# EasyEDA Pro project MicrowaveOvenControl.eprj

# Schematic Schematic1
Board Name: Board1; Create Date: 2025-04-27; Page Name: P1; Project Name: MicrowaveOwenControl; Schematic Name: Schematic1; Update Date: 2025-05-22; Add into BOM: yes; Convert to PCB: yes
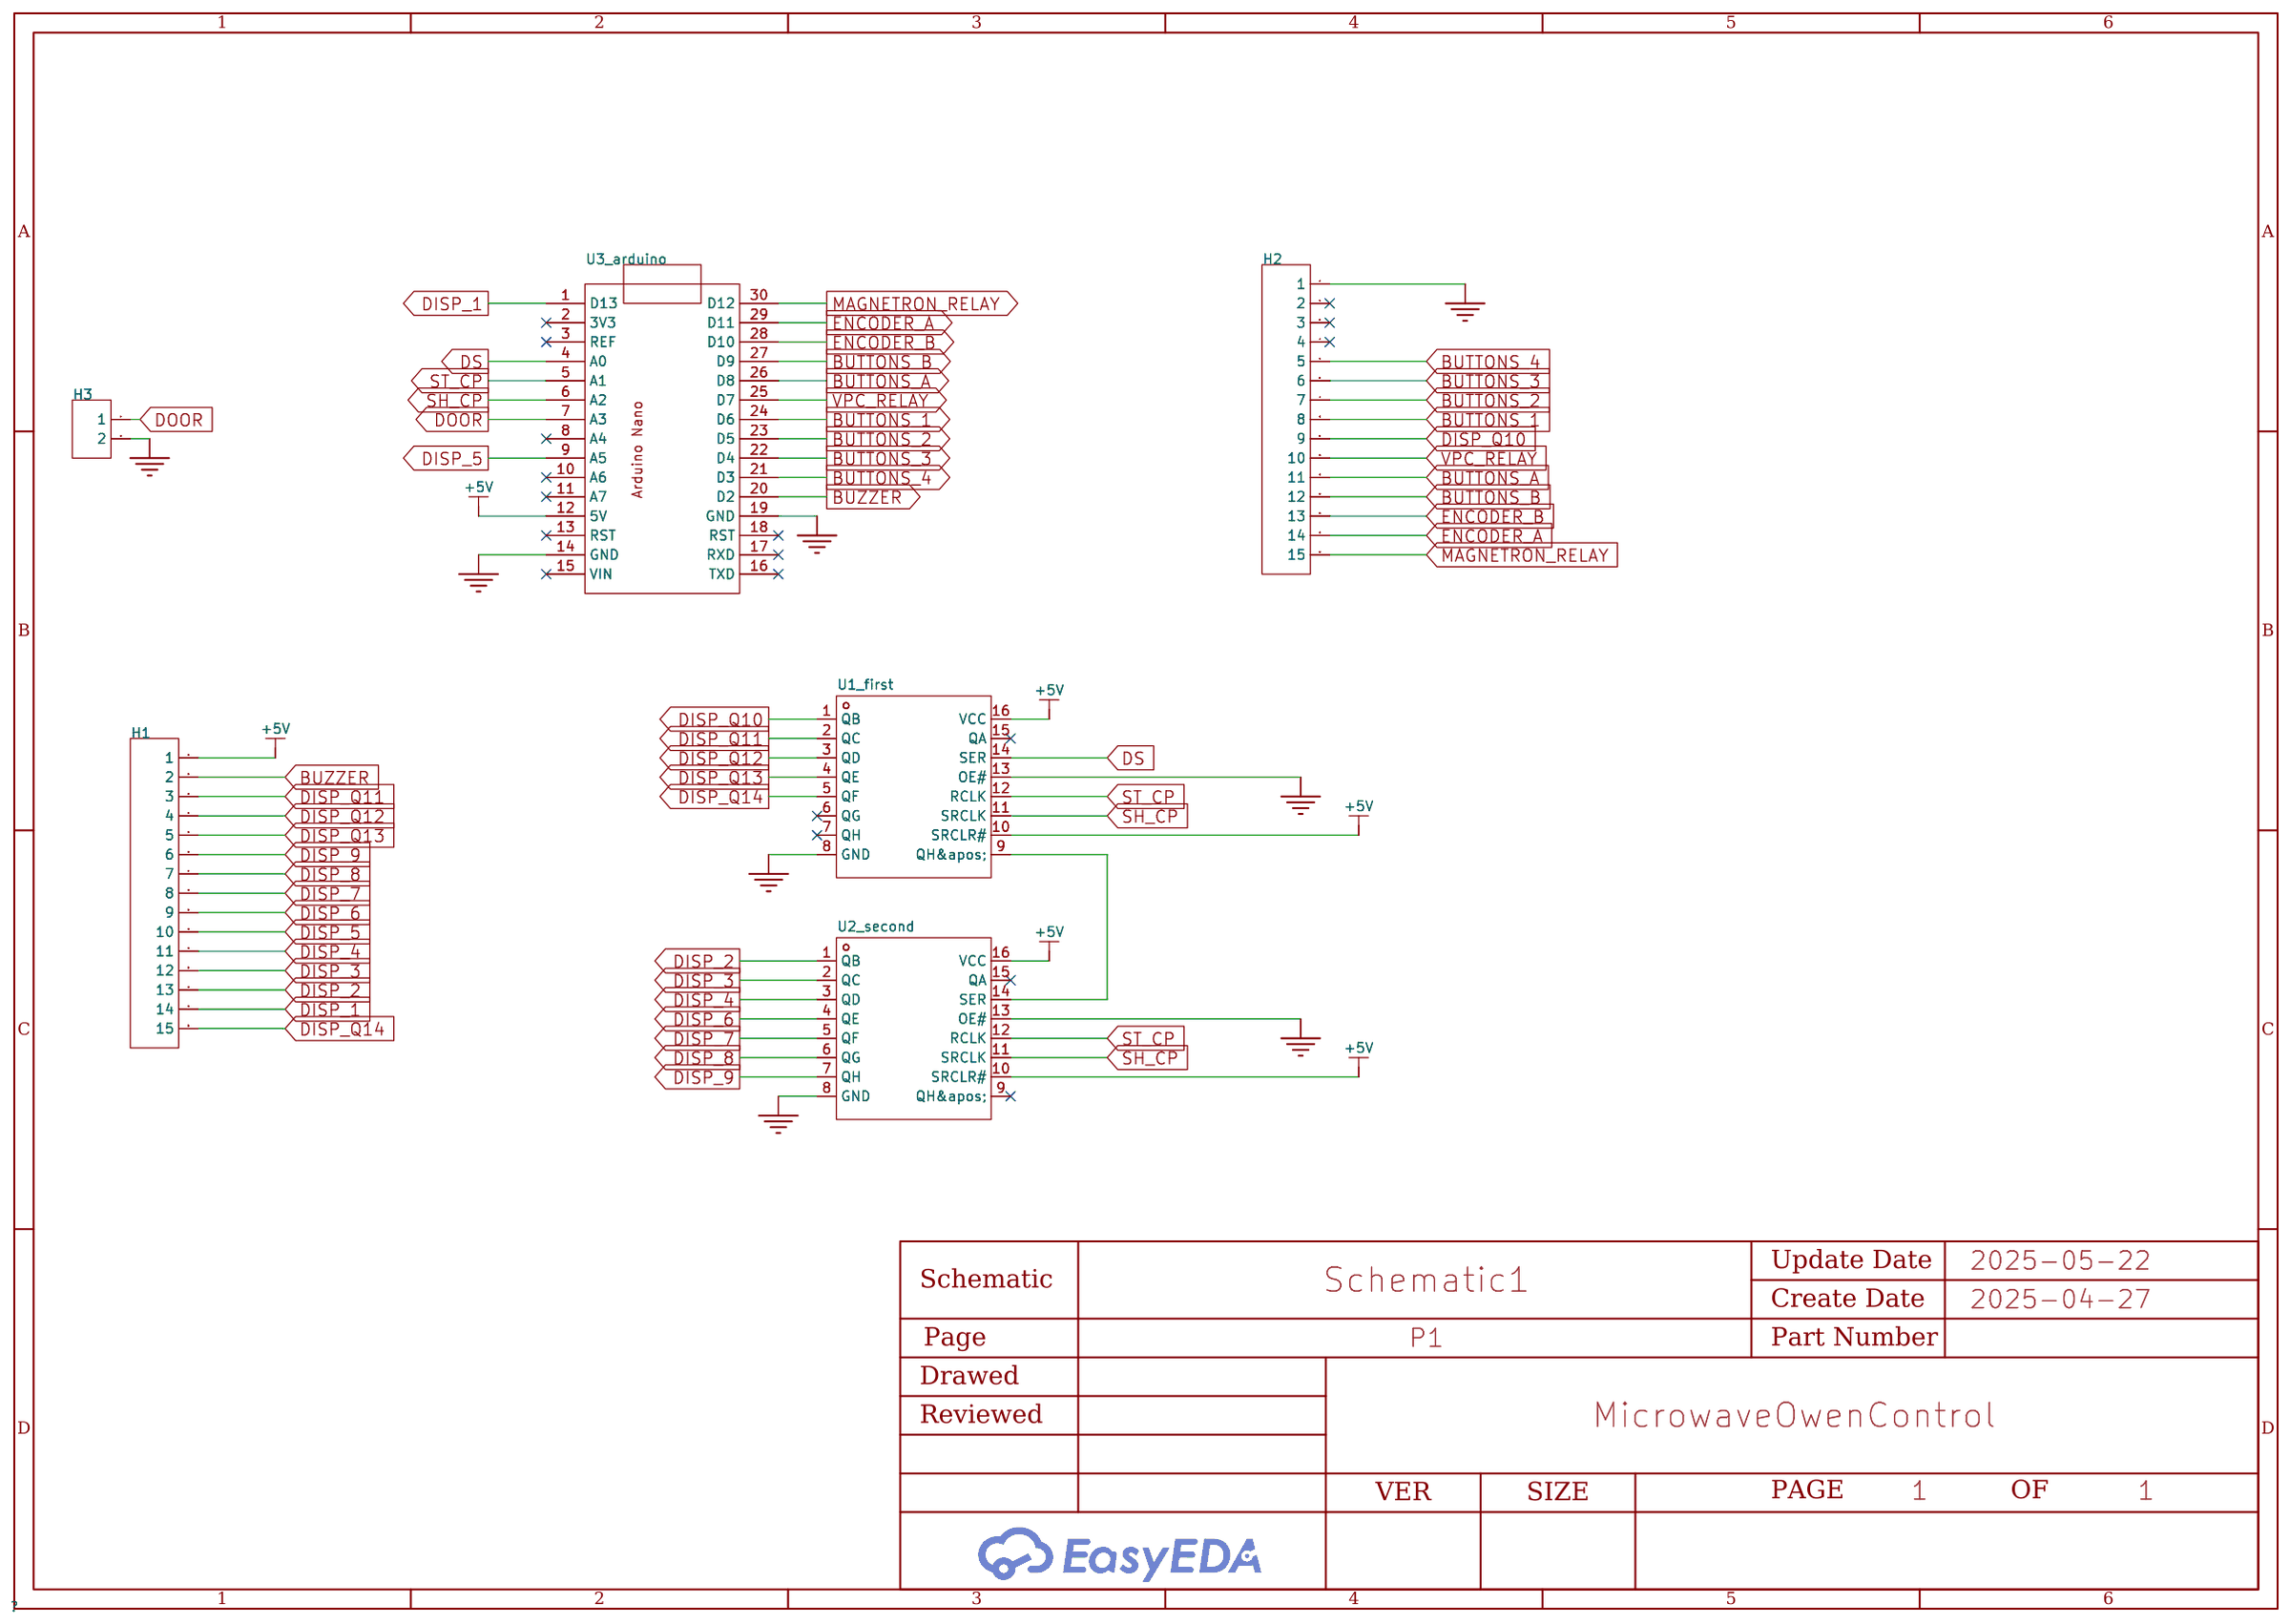
[diagram p0: schematic sheet]

## Parts
H1  -  [HDR-TH_15P-P2.54-V-F-1]
H2  -  [HDR-TH_15P-P2.54-V-F-1]
H3  -  [HDR-TH_2P-P2.54-V-F]
U1_first  -  [DIP-16_L19.8-W6.5-P2.54-LS7.6-BL]
U2_second  -  [DIP-16_L19.8-W6.5-P2.54-LS7.6-BL]
U3_arduino  -  [ArduinoNanoFootprint]

## Library data of the parts
H1 H2 = HDR-F_2.54_1x15P: Supplier Part: C124408; Supplier Footprint: 插件,; Holes Structure: 1x15P; Pitch: 2.54mm; Mounting Type: Straight; Number of Rows: Plugin; Number of Holes: 15P; Contact Material: Brass
H3 = HDR-F_2.54_1x2P: Supplier Part: C49661; Supplier Footprint: 插件; Holes Structure: 1x2P; Pitch: 2.54mm; Mounting Type: Straight; Number of Rows: Plugin; Number of Holes: 2P
U1_first U2_second = SN74HC595N: Supplier Part: C78711; Manufacturer: TI(德州仪器); Supplier Footprint: DIP-16; JLCPCB Part Class: Extended Part; Datasheet: https://atta.szlcsc.com/upload/public/pdf/source/20160718/1468827478635.pdf; Supplier: LCSC
U3_arduino = ArduinoNano

## Nets
+5V: H1.1 U1_first.10(SRCLR#) U1_first.16(VCC) U2_second.10(SRCLR#) U2_second.16(VCC) U3_arduino.12(5V)
GND: H2.1 H3.2 U1_first.8(GND) U1_first.13(OE#) U2_second.8(GND) U2_second.13(OE#) U3_arduino.14(GND) U3_arduino.19(GND)
BUTTONS_1: H2.8 U3_arduino.24(D6)
BUTTONS_2: H2.7 U3_arduino.23(D5)
BUTTONS_3: H2.6 U3_arduino.22(D4)
BUTTONS_4: H2.5 U3_arduino.21(D3)
BUTTONS_A: H2.11 U3_arduino.26(D8)
BUTTONS_B: H2.12 U3_arduino.27(D9)
BUZZER: H1.2 U3_arduino.20(D2)
DISP_1: H1.14 U3_arduino.1(D13)
DISP_2: H1.13 U2_second.1(QB)
DISP_3: H1.12 U2_second.2(QC)
DISP_4: H1.11 U2_second.3(QD)
DISP_5: H1.10 U3_arduino.9(A5)
DISP_6: H1.9 U2_second.4(QE)
DISP_7: H1.8 U2_second.5(QF)
DISP_8: H1.7 U2_second.6(QG)
DISP_9: H1.6 U2_second.7(QH)
DISP_Q10: H2.9 U1_first.1(QB)
DISP_Q11: H1.3 U1_first.2(QC)
DISP_Q12: H1.4 U1_first.3(QD)
DISP_Q13: H1.5 U1_first.4(QE)
DISP_Q14: H1.15 U1_first.5(QF)
DOOR: H3.1 U3_arduino.7(A3)
DS: U1_first.14(SER) U3_arduino.4(A0)
ENCODER_A: H2.14 U3_arduino.29(D11)
ENCODER_B: H2.13 U3_arduino.28(D10)
MAGNETRON_RELAY: H2.15 U3_arduino.30(D12)
SH_CP: U1_first.11(SRCLK) U2_second.11(SRCLK) U3_arduino.6(A2)
ST_CP: U1_first.12(RCLK) U2_second.12(RCLK) U3_arduino.5(A1)
VPC_RELAY: H2.10 U3_arduino.25(D7)
$1N1304: U1_first.9(QH&apos;) U2_second.14(SER)

Not connected (* = marked no-connect by the designer): H2 2* 3* 4*; U1_first 6(QG)* 7(QH)* 15(QA)*; U2_second 9(QH&apos;)* 15(QA)*; U3_arduino 2(3V3)* 3(REF)* 8(A4)* 10(A6)* 11(A7)* 13(RST)* 15(VIN)* 16(TXD)* 17(RXD)* 18(RST)*

# Board PCB1
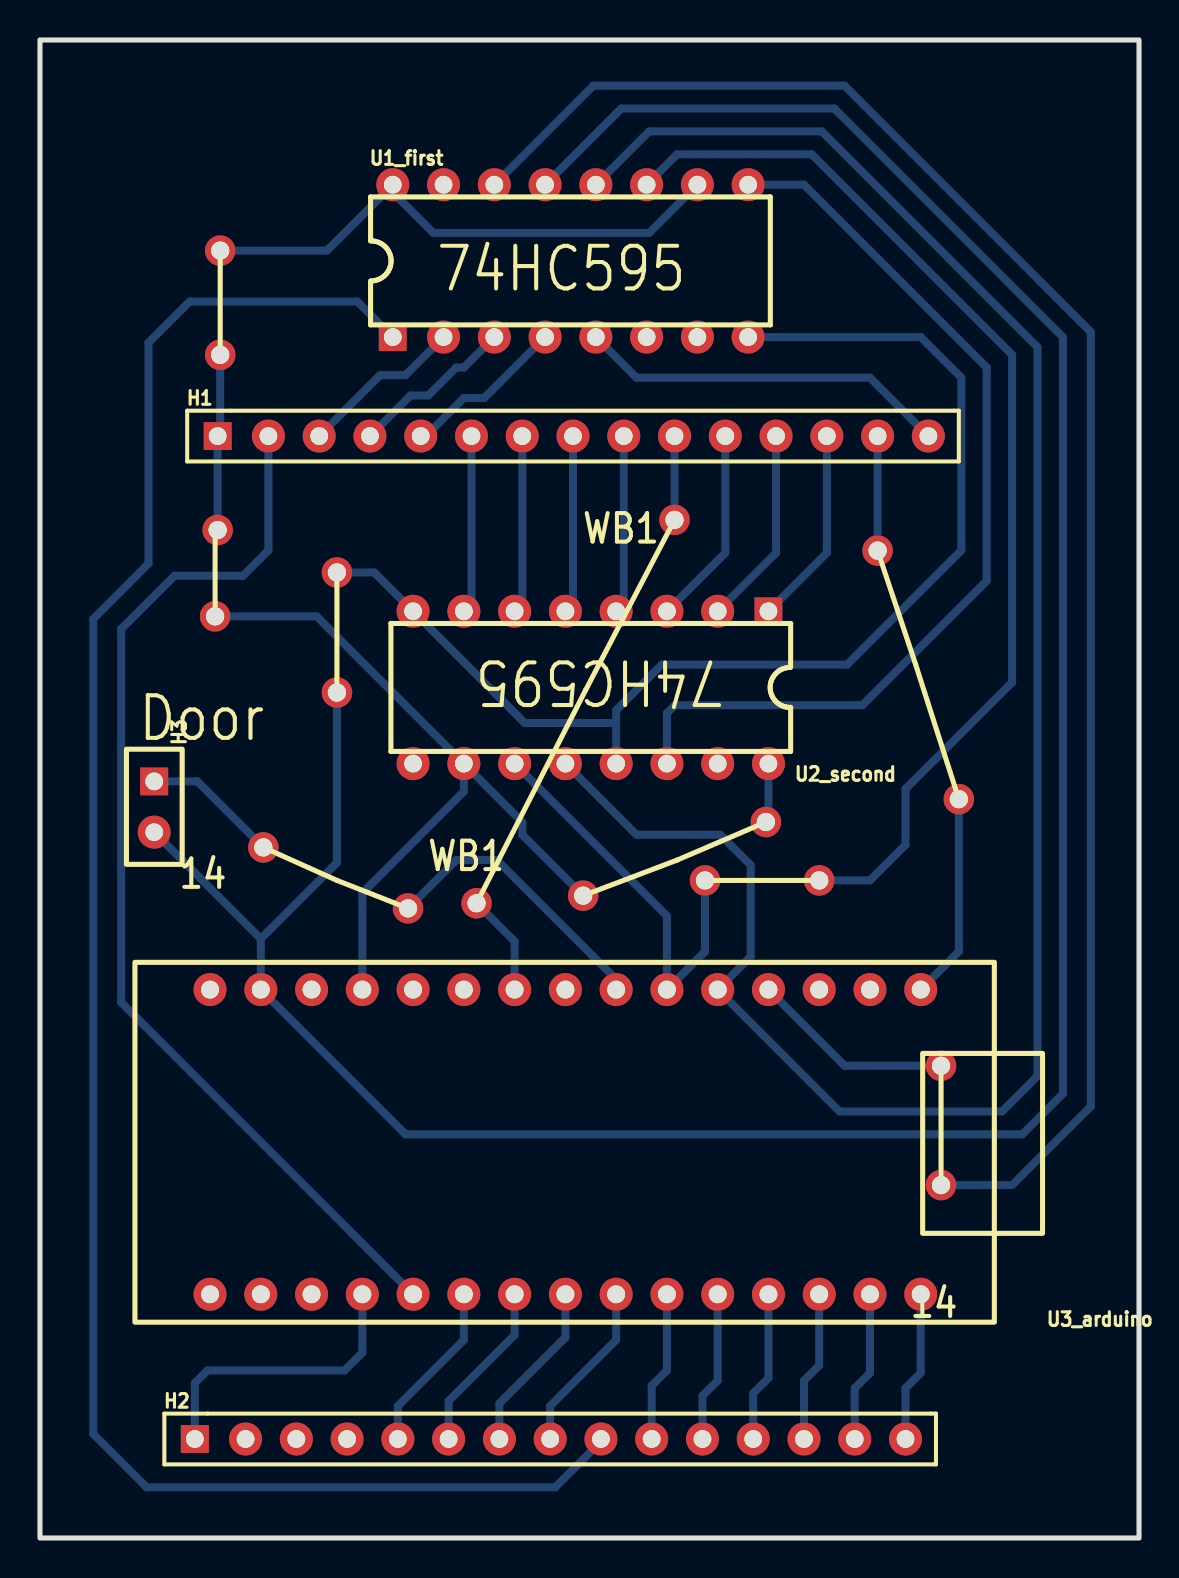
[diagram p1: board, top side]
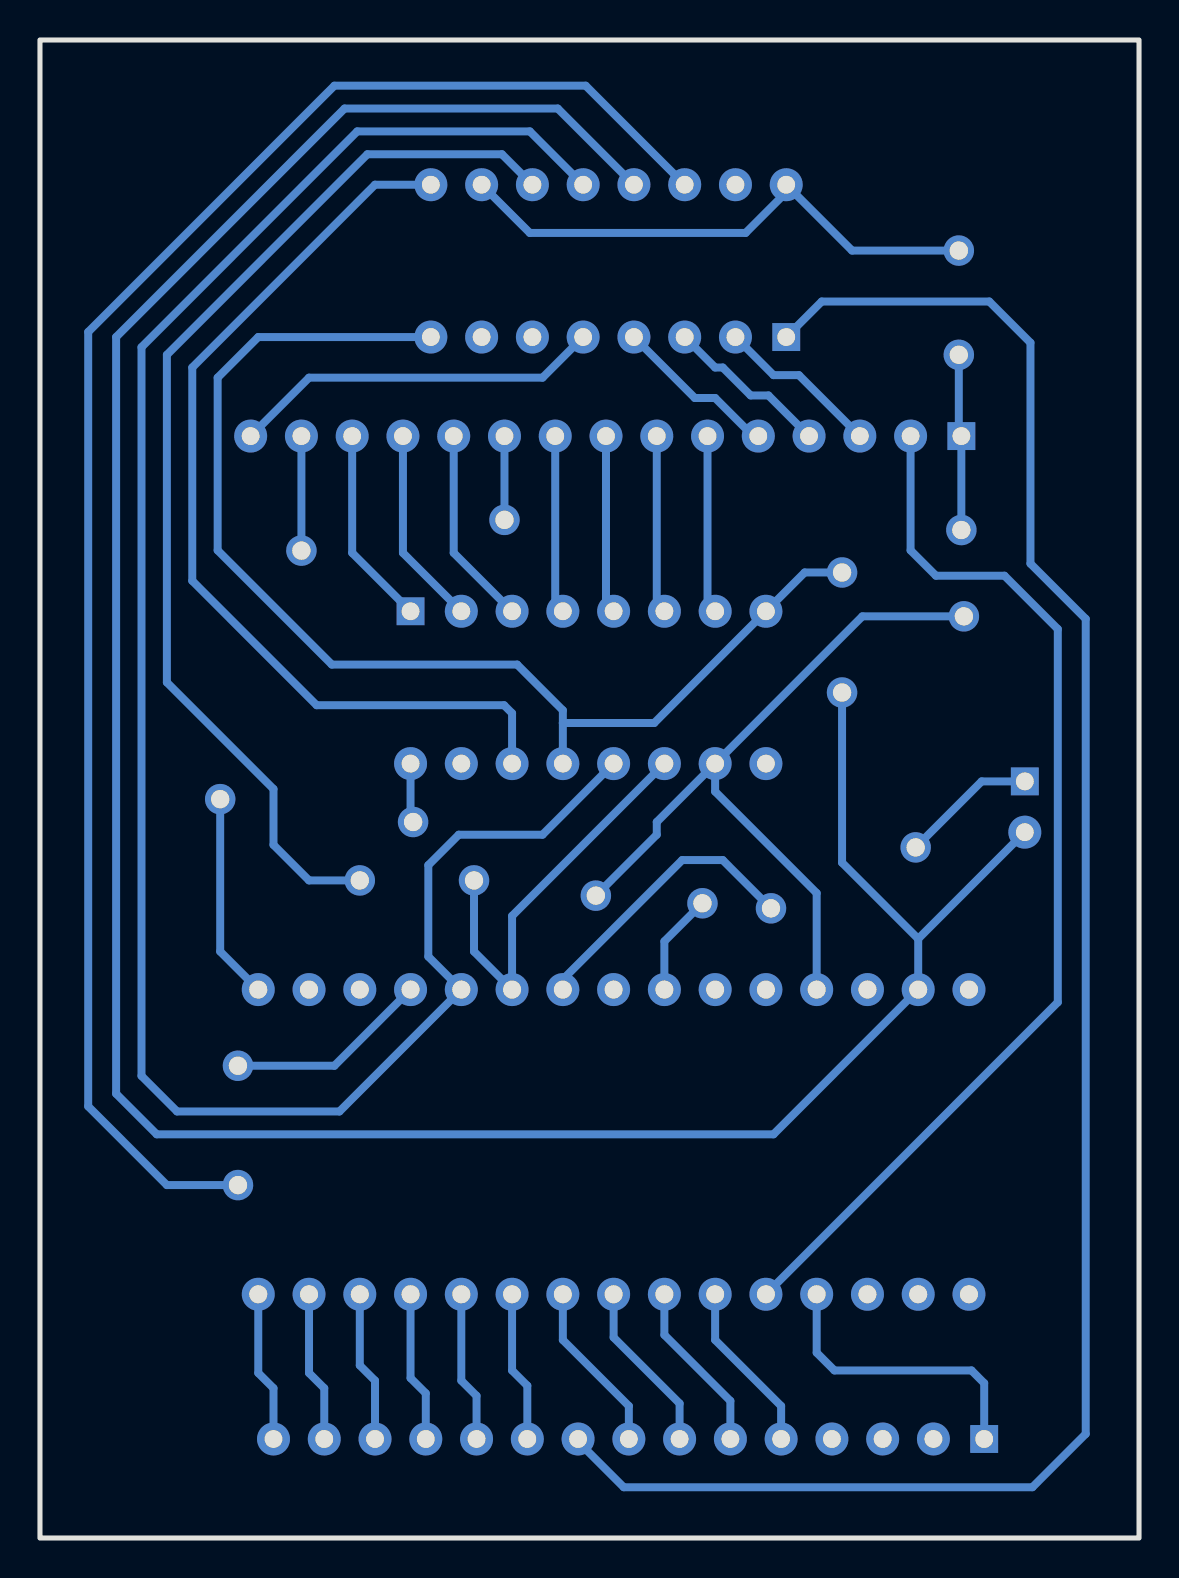
[diagram p2: board, bottom side, seen from below]

Outline 54.99 x 74.93 mm; copper layers: Top Layer, Bottom Layer. Coordinates in mm from the lower left corner of the outline.
Outline path: rectangle 0,74.93 54.99,0
Stack: Top Layer 0.035mm / Dielectric1 1.51mm FR4 er 4.5 / Bottom Layer 0.035mm

## Design rules (mm)
template: Custom Config
spacing copperThickness1oz (default): track to track 0.102, other pairs 0.152 to 0.3
spacing copperThickness2oz: track to track 0.203, other pairs 0.152 to 0.3
track width copperThickness1oz (default): min 0.254, default 0.4, max 2.54
track width copperThickness2oz: min 0.203, default 0.254, max 2.54
differential pair differentialPair (default): width min 0.127, default 0.254, max 2.54; gap min 0.152, default 0.152
via viaSize (default): diameter min 0.5, default 0.61, max 10; hole min 0.3, default 0.305, max 6.3

## Placement (name value [footprint] x y rotation side)
H1  -  [HDR-TH_15P-P2.54-V-F-1]  26.67 55.12 0 top
H2  -  [HDR-TH_15P-P2.54-V-F-1]  25.53 4.95 0 top
H3  -  [HDR-TH_2P-P2.54-V-F]  5.71 36.58 270 top
NOREF  -  [Pad_e9931]  21.84 31.75 0 top
NOREF#2  -  [Pad_e9986]  11.18 34.54 0 top
NOREF#3  -  [Pad_e9928]  31.75 50.93 0 top
NOREF#4  -  [Pad_e10002]  9.02 59.18 0 top
NOREF#5  -  [Pad_e10129]  45.97 36.96 0 top
NOREF#6  -  [Pad_e10133]  41.91 49.39 0 top
NOREF#7  -  [Pad_e9990]  8.76 46.1 0 top
NOREF#8  -  [Pad_e9959]  27.18 32.13 0 top
NOREF#9  -  [Pad_e10066]  45.08 23.62 0 top
NOREF#10  -  [Pad_e10003]  9.02 64.4 0 top
NOREF#11  -  [Pad_e9989]  8.89 50.42 0 top
NOREF#12  -  [Pad_e9755]  38.99 32.89 0 top
NOREF#13  -  [Pad_e9969]  18.42 31.5 0 top
NOREF#14  -  [Pad_e10256]  14.86 42.29 0 top
NOREF#15  -  [Pad_e10095]  45.08 17.65 0 top
NOREF#16  -  [Pad_e10045]  36.32 35.81 0 top
NOREF#17  -  [Pad_e10257]  14.86 48.3 0 top
NOREF#18  -  [Pad_e9963]  33.27 32.89 0 top
U1_first  -  [DIP-16_L19.8-W6.5-P2.54-LS7.6-BL]  26.54 63.88 0 top
U2_second  -  [DIP-16_L19.8-W6.5-P2.54-LS7.6-BL]  27.56 42.55 180 top
U3_arduino  -  [ArduinoNanoFootprint]  -5.33 34.04 180 top

## Footprints (pads in the part's own frame, mm; a bottom-side part is the same pattern mirrored in y, then rotated)
ArduinoNanoFootprint
  round 1.651 hole 0.9x0.889: 1(-49.403,6.604) 2(-46.863,6.604) 3(-44.323,6.604) 4(-41.783,6.604) 5(-39.243,6.604) 6(-36.703,6.604) 7(-34.163,6.604) 8(-31.623,6.604) 9(-29.083,6.604) 10(-26.543,6.604) 11(-24.003,6.604) 12(-21.463,6.604) 13(-18.923,6.604) 14(-16.383,6.604) 15(-13.843,6.604) 16(-13.843,21.844) 17(-16.383,21.844) 18(-18.923,21.844) 19(-21.463,21.844) 20(-24.003,21.844) 21(-26.543,21.844) 22(-29.083,21.844) 23(-31.623,21.844) 24(-34.163,21.844) 25(-36.703,21.844) 26(-39.243,21.844) 27(-41.783,21.844) 28(-44.323,21.844) 29(-46.863,21.844) 30(-49.403,21.844)
DIP-16_L19.8-W6.5-P2.54-LS7.6-BL
  rect 1.397x1.397 hole 0.889: 1(-8.89,-3.81)
  round 1.651 hole 0.889: 2(-6.35,-3.81) 3(-3.81,-3.81) 4(-1.27,-3.81) 5(1.27,-3.81) 6(3.81,-3.81) 7(6.35,-3.81) 8(8.89,-3.81) 9(8.89,3.81) 10(6.35,3.81) 11(3.81,3.81) 12(1.27,3.81) 13(-1.27,3.81) 14(-3.81,3.81) 15(-6.35,3.81) 16(-8.89,3.81)
HDR-TH_2P-P2.54-V-F
  rect 1.397x1.397 hole 0.889: 1(-1.27,0)
  round 1.651 hole 0.889: 2(1.27,0)
HDR-TH_15P-P2.54-V-F-1
  rect 1.397x1.397 hole 0.889: 1(-17.78,0)
  round 1.651 hole 0.889: 2(-15.24,0) 3(-12.7,0) 4(-10.16,0) 5(-7.62,0) 6(-5.08,0) 7(-2.54,0) 8(0,0) 9(2.54,0) 10(5.08,0) 11(7.62,0) 12(10.16,0) 13(12.7,0) 14(15.24,0) 15(17.78,0)
Pad_e9755
  round 1.524 hole 0.914: 1(0,0)
Pad_e9928
  round 1.524 hole 0.914: 1(0,0)
Pad_e9931
  round 1.524 hole 0.914: 1(0,0)
Pad_e9959
  round 1.524 hole 0.914: 1(0,0)
Pad_e9963
  round 1.524 hole 0.914: 1(0,0)
Pad_e9969
  round 1.524 hole 0.914: 1(0,0)
Pad_e9986
  round 1.524 hole 0.914: 1(0,0)
Pad_e9989
  round 1.524 hole 0.914: 1(0,0)
Pad_e9990
  round 1.524 hole 0.914: 2(0,0)
Pad_e10002
  round 1.524 hole 0.914: 1(0,0)
Pad_e10003
  round 1.524 hole 0.914: 2(0,0)
Pad_e10045
  round 1.524 hole 0.914: 1(0,0)
Pad_e10066
  round 1.524 hole 0.914: 1(0,0)
Pad_e10095
  round 1.524 hole 0.914: 1(0,0)
Pad_e10129
  round 1.524 hole 0.914: 1(0,0)
Pad_e10133
  round 1.524 hole 0.914: 1(0,0)
Pad_e10256
  round 1.524 hole 0.914: 1(0,0)
Pad_e10257
  round 1.524 hole 0.914: 2(0,0)

## Nets
+5V: H1.1 NOREF#4.1 NOREF#7.2 NOREF#8.1 NOREF#10.2 NOREF#11.1 NOREF#16.1 U1_first.10 U1_first.16 U2_second.10 U2_second.16 U3_arduino.12
GND: H2.1 H3.2 NOREF#14.1 NOREF#17.2 U1_first.8 U1_first.13 U2_second.8 U2_second.13 U3_arduino.14 U3_arduino.19
BUTTONS_1: H2.8 U3_arduino.24
BUTTONS_2: H2.7 U3_arduino.23
BUTTONS_3: H2.6 U3_arduino.22
BUTTONS_4: H2.5 U3_arduino.21
BUTTONS_A: H2.11 U3_arduino.26
BUTTONS_B: H2.12 U3_arduino.27
BUZZER: H1.2 U3_arduino.20
DISP_1: H1.14 NOREF#5.1 NOREF#6.1 U3_arduino.1
DISP_2: H1.13 U2_second.1
DISP_3: H1.12 U2_second.2
DISP_4: H1.11 U2_second.3
DISP_5: H1.10 NOREF.1 NOREF#3.1 U3_arduino.9
DISP_6: H1.9 U2_second.4
DISP_7: H1.8 U2_second.5
DISP_8: H1.7 U2_second.6
DISP_9: H1.6 U2_second.7
DISP_Q10: H2.9 U1_first.1
DISP_Q11: H1.3 U1_first.2
DISP_Q12: H1.4 U1_first.3
DISP_Q13: H1.5 U1_first.4
DISP_Q14: H1.15 U1_first.5
DOOR: H3.1 NOREF#2.1 NOREF#13.1 U3_arduino.7
DS: NOREF#9.1 NOREF#15.1 U1_first.14 U3_arduino.4
ENCODER_A: H2.14 U3_arduino.29
ENCODER_B: H2.13 U3_arduino.28
MAGNETRON_RELAY: H2.15 U3_arduino.30
SH_CP: NOREF#12.1 NOREF#18.1 U1_first.11 U2_second.11 U3_arduino.6
ST_CP: U1_first.12 U2_second.12 U3_arduino.5
VPC_RELAY: H2.10 U3_arduino.25
$1N1304: U1_first.9 U2_second.14

Pads without a net: H2 2 3 4; U1_first 6 7 15; U2_second 9 15; U3_arduino 2 3 8 10 11 13 15 16 17 18

## Routing (per net, layer and track width the routed paths; a pad name or vN(x,y) marks a point on that pad's centre or on a via; arc(x,y) is an arc through that point)
+5V: length 77.2
  Bottom Layer w0.4: U1_first.10 30.48,65.28 19.69,65.28 17.69,67.27 17.69,67.65 U1_first.16 14.36,64.4 NOREF#10.2 ; NOREF#16.1 36.45,35.94 U2_second.16 ; U2_second.10 13.84,46.1 NOREF#7.2 ; U2_second.10 24.13,35.81 24.13,35.18 NOREF#8.1 ; U2_second.10 21.21,37.34 16.13,32.26 U3_arduino.12 ; NOREF#11.1 H1.1 9.02,55.25 NOREF#4.1
GND: length 213.2
  Bottom Layer w0.4: 11.05,29.97 U3_arduino.14 18.29,20.19 49.15,20.19 51.18,22.22 51.18,60.07 39.75,71.5 29.08,71.5 U1_first.13 ; 11.05,29.97 H3.2 ; 11.05,29.97 14.86,33.78 NOREF#14.1 ; U2_second.13 28.83,40.77 ; 28.83,40.77 24.26,40.77 U2_second.8 16.73,48.3 NOREF#17.2 ; 28.83,40.77 28.83,41.4 31.11,43.69 40.39,43.69 46.1,49.4 46.1,58.04 44.07,60.07 U1_first.8 ; U3_arduino.19 16.13,9.27 15.24,8.38 8.38,8.38 7.75,7.75 H2.1
BUTTONS_1: length 8.6
  Bottom Layer w0.4: U3_arduino.24 28.83,9.91 25.53,6.6 H2.8
BUTTONS_2: length 8.6
  Bottom Layer w0.4: U3_arduino.23 26.29,10.03 22.99,6.73 H2.7
BUTTONS_3: length 8.6
  Bottom Layer w0.4: H2.6 20.45,6.86 23.75,10.16 U3_arduino.22
BUTTONS_4: length 8.6
  Bottom Layer w0.4: H2.5 17.91,6.6 21.21,9.91 U3_arduino.21
BUTTONS_A: length 7.6
  Bottom Layer w0.4: H2.11 33.15,7.11 33.91,7.87 U3_arduino.26
BUTTONS_B: length 7.6
  Bottom Layer w0.4: U3_arduino.27 36.45,8 35.69,7.24 H2.12
BUZZER: length 54
  Bottom Layer w0.4: H1.2 11.43,49.4 10.16,48.13 6.73,48.13 4.06,45.47 4.06,26.8 U3_arduino.20
DISP_1: length 16
  Bottom Layer w0.4: NOREF#5.1 45.97,29.34 U3_arduino.1 ; H1.14 NOREF#6.1
DISP_2: length 10
  Bottom Layer w0.4: U2_second.1 39.37,49.28 H1.13
DISP_3: length 10
  Bottom Layer w0.4: H1.12 36.83,49.28 U2_second.2
DISP_4: length 10
  Bottom Layer w0.4: U2_second.3 34.29,49.28 H1.11
DISP_5: length 9.3
  Bottom Layer w0.4: NOREF.1 23.75,29.84 U3_arduino.9 ; H1.10 NOREF#3.1
DISP_6: length 8.9
  Bottom Layer w0.4: U2_second.4 29.21,46.74 H1.9
DISP_7: length 8.9
  Bottom Layer w0.4: H1.8 26.67,46.74 U2_second.5
DISP_8: length 8.9
  Bottom Layer w0.4: H1.7 24.13,46.74 U2_second.6
DISP_9: length 8.9
  Bottom Layer w0.4: U2_second.7 21.59,46.74 H1.6
DISP_Q10: length 97.1
  Bottom Layer w0.4: H2.9 28.07,4.83 25.78,2.54 5.33,2.54 2.67,5.21 2.67,45.97 5.43,48.74 5.43,59.79 7.49,61.85 15.88,61.85 U1_first.1
DISP_Q11: length 8.3
  Bottom Layer w0.4: U1_first.2 18.29,58.17 17.02,58.17 H1.3
DISP_Q12: length 8.3
  Bottom Layer w0.4: U1_first.3 21.21,58.55 20.83,58.55 19.43,57.15 18.54,57.15 H1.4
DISP_Q13: length 8.3
  Bottom Layer w0.4: U1_first.4 22.23,57.02 21.21,57.02 19.3,55.12 H1.5
DISP_Q14: length 18.7
  Bottom Layer w0.4: H1.15 41.53,58.04 29.85,58.04 U1_first.5
DOOR: length 21.2
  Bottom Layer w0.4: NOREF#2.1 7.87,37.85 H3.1 ; NOREF#13.1 20.83,33.91 22.86,33.91 28.83,27.94 U3_arduino.7
DS: length 95.1
  Bottom Layer w0.4: U1_first.14 27.69,72.64 40.26,72.64 52.58,60.33 52.58,21.59 48.64,17.65 NOREF#15.1 ; NOREF#9.1 40.26,23.62 U3_arduino.4
ENCODER_A: length 7.6
  Bottom Layer w0.4: H2.14 40.77,7.49 41.53,8.25 U3_arduino.29
ENCODER_B: length 7.6
  Bottom Layer w0.4: H2.13 38.23,7.87 38.99,8.64 U3_arduino.28
MAGNETRON_RELAY: length 7.6
  Bottom Layer w0.4: H2.15 43.31,7.49 44.07,8.25 U3_arduino.30
SH_CP: length 75.6
  Bottom Layer w0.4: U2_second.11 31.37,31.11 U3_arduino.6 33.27,29.34 NOREF#18.1 ; U1_first.11 31.88,69.22 38.61,69.22 48.64,59.18 48.64,42.8 43.31,37.47 43.31,34.67 41.53,32.89 NOREF#12.1
ST_CP: length 101.7
  Bottom Layer w0.4: U1_first.12 30.48,70.36 39.12,70.36 49.91,59.56 49.91,23.11 48.13,21.34 40.01,21.34 U3_arduino.5 35.56,29.08 35.56,33.66 34.04,35.18 29.85,35.18 U2_second.12
VPC_RELAY: length 7.6
  Bottom Layer w0.4: U3_arduino.25 31.37,8.38 30.61,7.62 H2.10
$1N1304: length 47.7
  Bottom Layer w0.4: U1_first.9 38.23,67.69 47.37,58.55 47.37,47.88 41.15,41.66 31.77,41.66 31.37,41.26 U2_second.14

## Text on the board
Top Silkscreen Layer: 14 | WB1 | Door | 74HC595
